# Altium schematic sheet Final_Embedded.SchDoc
size A4; SheetNumber: 1; SheetTotal: 1
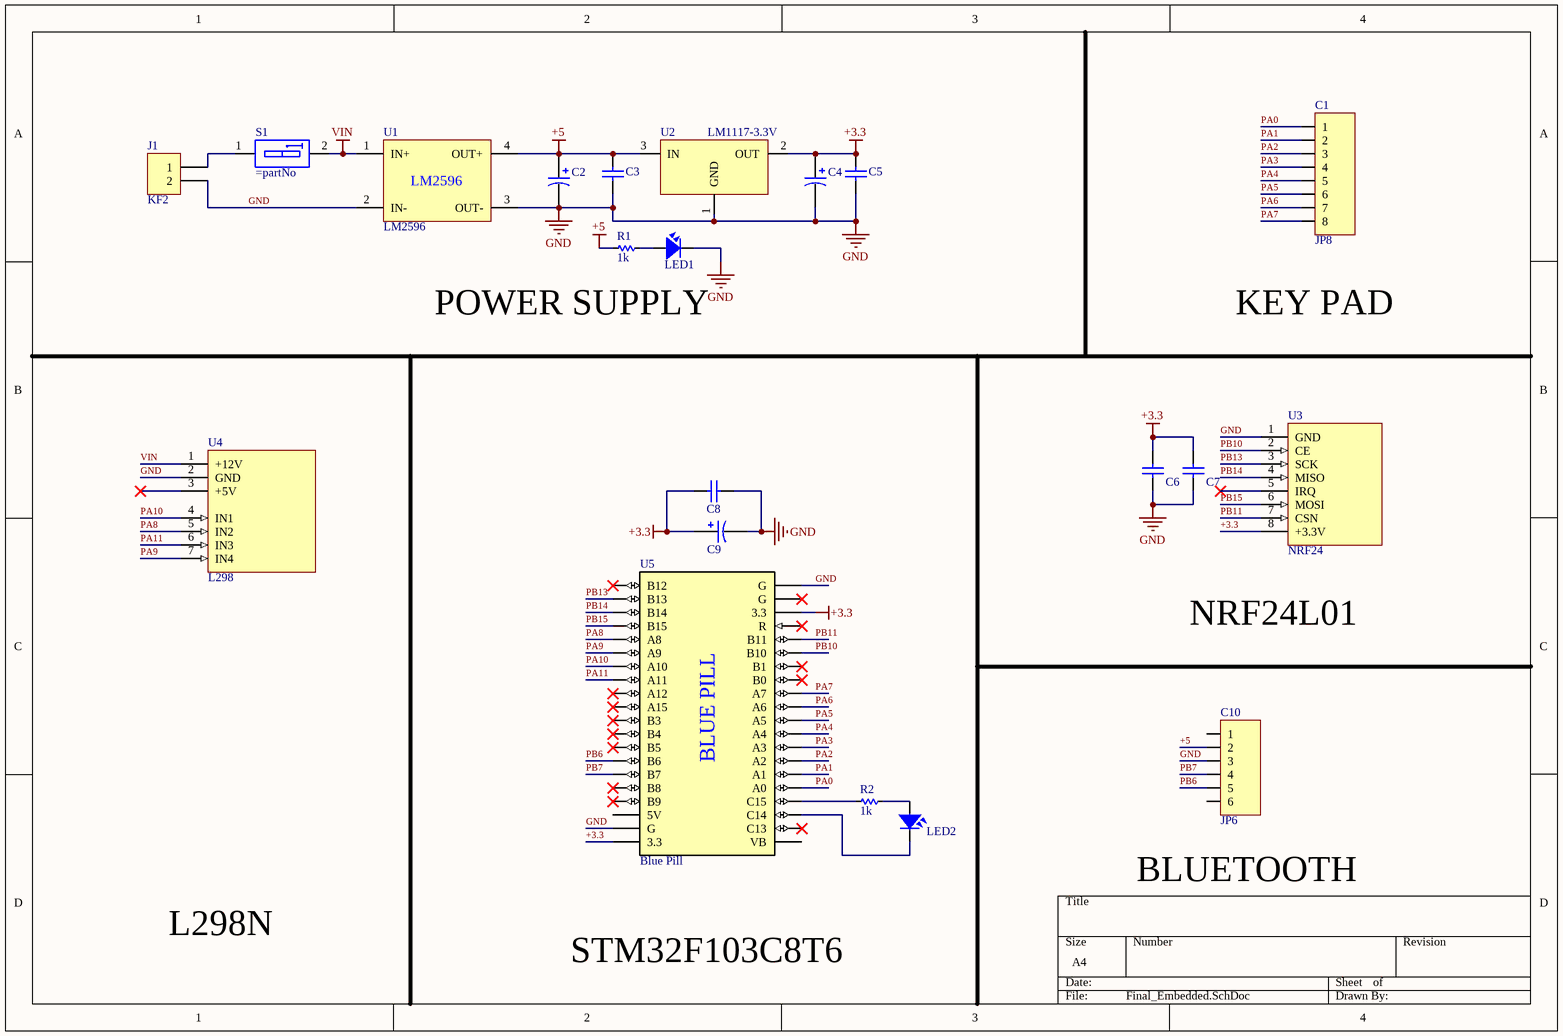
[diagram p0: Final_Embedded.SchDoc]

## Parts
C1  JP8  [JP8-D1T]
C2  47uF  [CAP_ALUM_D080_S35_H115]  (value not drawn)
C3  104  [Tu-pico]  (value not drawn)
C4  47uF  [CAP_ALUM_D080_S35_H115]  (value not drawn)
C5  104  [Tu-pico]  (value not drawn)
C6  104  [Tu-pico]  (value not drawn)
C7  104  [Tu-pico]  (value not drawn)
C8  104  [Tu-pico]  (value not drawn)
C9  47uF  [CAP_ALUM_D080_S35_H115]  (value not drawn)
C10  JP6  [JP6-C1T]
J1  KF2  [KF2-5.08]
LED1  LED  [LED-3MM-RED]  (value not drawn)
LED2  LED  [LED-3MM-GREEN]  (value not drawn)
R1  1k  [RES-1/4W-SMALL]
R2  1k  [RES-1/8W-SMALL]
S1  (no value)  [SW-DIP1]
U1  LM2596  [LM2596 Module]
U2  LM1117-3.3V  [TO220-123]
U3  NRF24  [NRF24L01 Module]
U4  L298  [L298N Module]
U5  Blue Pill  [Blue Pill STM32F103]

## Nets
+3.3: C4.1 C5.2 C6.1 C7.1 C8.1 C9.1 U2.2(OUT) U3.8(+3.3V) U5.20(3.3) U5.38(3.3)
+5: C2.1 C3.2 C10.2 R1.2 U1.4(OUT+) U2.3(IN)
GND: C2.2 C3.1 C4.2 C5.1 C6.2 C7.2 C8.2 C9.2 C10.3 J1.2 LED1.2 U1.2(IN-) U1.3(OUT-) U2.1(GND) U3.1(GND) U4.2(GND) U5.19(G) U5.40(G)
VIN: S1.2 U1.1(IN+) U4.1(+12V)
PA0: C1.1 U5.25(A0)
PA1: C1.2 U5.26(A1)
PA2: C1.3 U5.27(A2)
PA3: C1.4 U5.28(A3)
PA4: C1.5 U5.29(A4)
PA5: C1.6 U5.30(A5)
PA6: C1.7 U5.31(A6)
PA7: C1.8 U5.32(A7)
PA8: U4.5(IN2) U5.5(A8)
PA9: U4.7(IN4) U5.6(A9)
PA10: U4.4(IN1) U5.7(A10)
PA11: U4.6(IN3) U5.8(A11)
PB6: C10.5 U5.14(B6)
PB7: C10.4 U5.15(B7)
PB10: U3.2(CE) U5.35(B10)
PB11: U3.7(CSN) U5.36(B11)
PB13: U3.3(SCK) U5.2(B13)
PB14: U3.4(MISO) U5.3(B14)
PB15: U3.6(MOSI) U5.4(B15)
NetJ1_1: J1.1 S1.1
NetLED1_1: LED1.1 R1.1
NetLED2_1: LED2.1 R2.1
NetLED2_2: LED2.2 U5.23(C14)
NetR2_2: R2.2 U5.24(C15)

Not connected (* = marked no-connect by the designer): C10 1 6; U3 5(IRQ)*; U4 3(+5V)*; U5 1(B12)* 9(A12)* 10(A15)* 11(B3)* 12(B4)* 13(B5)* 16(B8)* 17(B9)* 18(5V) 21(VB) 22(C13)* 33(B0)* 34(B1)* 37(R)* 39(G)*

## Notes on the sheet
- POWER SUPPLY
- KEY PAD
- NRF24L01
- L298N
- (near C10) BLUETOOTH
- STM32F103C8T6
- (in symbol Blue Pill STM32F103) BLUE PILL

## Library data of the parts
C1 = JP8: WR-PHD 2.54 mm Angled Socket Header; Manufacturer: W¨¹rth Elektronik eiSos GmbH; partNo: 613008143121; ComponentLink1 Description: Manufacturer; ComponentLink2 Description: Datasheet; NoPins: 08; Created Date: 29 March 2013; ComponentLink1URL: http://www.we-online.com; ComponentLink2URL: http://katalog.we-online.de/em/datasheet/6130xx143121.pdf; Created by: Karrer Zheng
C2 C4 C9 = CLA4512: CAP ALUM 47uF 20% 63V RADIAL; Value: 47uF/63V; Solder: WAVE; MPN: CLA4512; Category: CAPACITOR; MFR_URL: http://linhkienchatluong.vn/tu-hoa-chat-luong-cao/tu-hoa-63v-47uf-nipponlelon-8x11mm_sp977_ct6500.aspx; PinCount: 2
C3 C5-C8 = CapCeramic: Capacitor; Value: 33p; Published: 8-Jun-2000; LatestRevisionDate: 17-Jul-2002; LatestRevisionNote: Re-released for DXP Platform.; PackageReference: RAD-0.3; Publisher: Altium Limited
C10 = JP6: WR-PHD 2.54 mm Angled Socket Header; Manufacturer: W¨¹rth Elektronik eiSos GmbH; partNo: 613006143121; ComponentLink1 Description: Manufacturer; ComponentLink2 Description: Datasheet; NoPins: 06; Created Date: 29 March 2013; ComponentLink1URL: http://www.we-online.com; ComponentLink2URL: http://katalog.we-online.de/em/datasheet/6130xx143121.pdf; Created by: Karrer Zheng
J1 = KF2: Manufacturer: Würth Elektronik eiSos GmbH; partNo: 691103110002; ComponentLink1 Description: Manufacturer; ComponentLink2 Description: Datasheet; NoPins: 2; Created Date: 29 October 2013; ComponentLink1URL: http://www.we-online.com; ComponentLink2URL: http://katalog.we-online.de/em/datasheet/6911031100xx.pdf; Created by: Karrer Zheng
LED1 LED2 = LED: LED Single colour Green and Red; Value: LED 3 ly Single Colour
R1 R2 = Res: Manufacturer: Generic Components; Class: Passive; SubClass: R; Published: 08/06/2000; Publisher: Altium Hobart Technology Centre
S1 = SWDIP1: WS-DITV 2.54 mm small compact THT flat actuator with top tape; Manufacturer: Wurth Elektronik; Part No.: 418127160901; ComponentLink1 Description: Manufacturer; ComponentLink2 Description: Datasheet; Pole: 01; Created Date: Dec.2015; ComponentLink1URL: http://www.we-online.com; ComponentLink2URL: http://katalog.we-online.de/em/datasheet/4181271609xx.pdf; Created by: Baojun Chen
U1 = LM2596 Module: DC - DC Buck
U2 = LM1117: 800mA Low-Dropout Linear Regulator; Creator: Nguyen Ba Bien; Website: http://group3i.net
U3 = NRF24L01 Module: NRF24L01
U4 = L298N Module: L298 Module
U5 = Blue Pill STM32F103: Blue Pill STM32F103C8T6